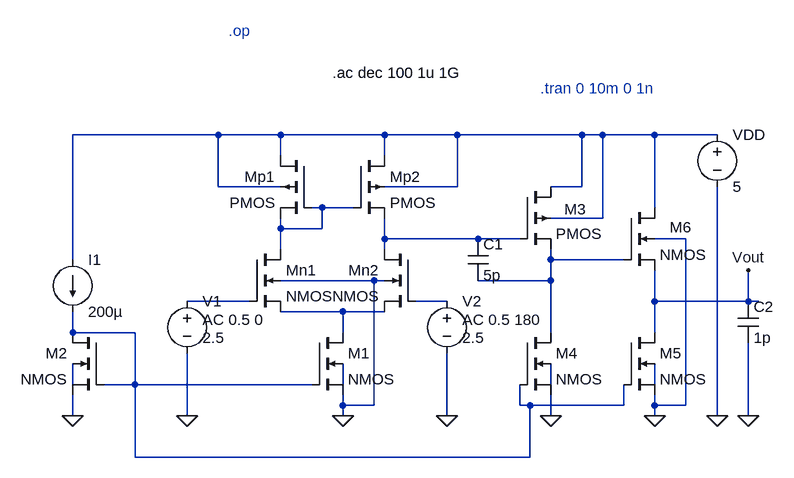
[diagram p0: schematic TWO STAGE DIFF AMPLIFIER PROJECT.asc]
TWO STAGE DIFF AMPLIFIER PROJECT.asc, the LTspice schematic file:
Version 4.1
SHEET 1 880 680
WIRE -240 0 -464 0
WIRE -144 0 -240 0
WIRE 16 0 -144 0
WIRE 128 0 16 0
WIRE 320 0 128 0
WIRE 352 0 320 0
WIRE 432 0 352 0
WIRE 528 0 432 0
WIRE -144 32 -144 0
WIRE 16 32 16 0
WIRE -240 80 -240 0
WIRE -144 80 -240 80
WIRE 128 80 128 0
WIRE 128 80 16 80
WIRE 320 80 320 0
WIRE 320 80 272 80
WIRE -80 112 -96 112
WIRE -32 112 -80 112
WIRE 432 112 432 0
WIRE 352 128 352 0
WIRE 352 128 272 128
WIRE -144 144 -144 128
WIRE -80 144 -80 112
WIRE -80 144 -144 144
WIRE 16 160 16 128
WIRE 160 160 16 160
WIRE 224 160 160 160
WIRE 480 160 432 160
WIRE -144 176 -144 144
WIRE 16 176 16 160
WIRE -464 192 -464 0
WIRE 272 192 272 176
WIRE 384 192 272 192
WIRE 0 224 -144 224
WIRE 16 224 0 224
WIRE 272 224 272 192
WIRE 272 224 160 224
WIRE -192 256 -288 256
WIRE 112 256 64 256
WIRE 432 256 432 208
WIRE 576 256 576 208
WIRE 576 256 432 256
WIRE 592 256 576 256
WIRE -48 272 -144 272
WIRE 16 272 -48 272
WIRE -464 304 -464 272
WIRE -368 304 -464 304
WIRE -48 304 -48 272
WIRE 272 304 272 224
WIRE 432 304 432 256
WIRE -464 384 -464 352
WIRE -368 384 -368 304
WIRE -368 384 -416 384
WIRE -96 384 -368 384
WIRE -48 384 -48 352
WIRE 272 384 272 352
WIRE 432 384 432 352
WIRE -48 416 -48 400
WIRE 0 416 0 224
WIRE 0 416 -48 416
WIRE 224 416 224 384
WIRE 240 416 224 416
WIRE 384 416 384 384
WIRE 384 416 240 416
WIRE 432 416 432 400
WIRE 480 416 480 160
WIRE 480 416 432 416
WIRE -464 432 -464 400
WIRE -288 432 -288 336
WIRE -48 432 -48 416
WIRE 112 432 112 336
WIRE 272 432 272 400
WIRE 432 432 432 416
WIRE 528 432 528 80
WIRE 576 432 576 320
WIRE -368 496 -368 384
WIRE 240 496 240 416
WIRE 240 496 -368 496
FLAG -48 432 0
FLAG -464 432 0
FLAG 272 432 0
FLAG 432 432 0
FLAG 528 432 0
FLAG -288 432 0
FLAG 112 432 0
FLAG 576 432 0
FLAG 576 208 Vout
SYMBOL current -464 192 R0
WINDOW 123 0 0 Left 0
WINDOW 39 0 0 Left 0
SYMATTR InstName I1
SYMATTR Value 200µ
SYMBOL voltage 528 -16 R0
WINDOW 123 0 0 Left 0
WINDOW 39 0 0 Left 0
SYMATTR InstName VDD
SYMATTR Value 5
SYMBOL cap 144 160 R0
SYMATTR InstName C1
SYMATTR Value 5p
SYMBOL voltage -288 240 R0
WINDOW 123 24 44 Left 2
WINDOW 39 0 0 Left 0
WINDOW 3 24 72 Left 2
SYMATTR Value2 AC 0.5 0
SYMATTR Value 2.5
SYMATTR InstName V1
SYMBOL voltage 112 240 R0
WINDOW 123 24 44 Left 2
WINDOW 39 0 0 Left 0
WINDOW 3 24 72 Left 2
SYMATTR Value2 AC 0.5 180
SYMATTR Value 2.5
SYMATTR InstName V2
SYMBOL cap 560 256 R0
SYMATTR InstName C2
SYMATTR Value 1p
SYMBOL pmos4 -32 32 R0
SYMATTR InstName Mp2
SYMATTR Value2 l=0.1u w=40u
SYMBOL pmos4 -96 32 M0
SYMATTR InstName Mp1
SYMATTR Value2 l=0.1u w=40u
SYMBOL nmos4 -192 176 R0
SYMATTR InstName Mn1
SYMATTR Value2 l=0.1u w=20u
SYMBOL nmos4 64 176 M0
SYMATTR InstName Mn2
SYMATTR Value2 l=0.1u w=20u
SYMBOL nmos4 -96 304 R0
SYMATTR InstName M1
SYMATTR Value2 l=2u w=10u
SYMBOL nmos4 -416 304 M0
SYMATTR InstName M2
SYMATTR Value2 l=2u w=10u
SYMBOL nmos4 384 304 R0
SYMATTR InstName M5
SYMATTR Value2 l=0.2u w=10u
SYMBOL nmos4 384 112 R0
WINDOW 0 71 30 Left 2
SYMATTR InstName M6
SYMATTR Value2 l=0.1u w=20u
SYMBOL pmos4 224 80 R0
WINDOW 0 69 34 Left 2
SYMATTR InstName M3
SYMATTR Value2 l=0.1u w=40u
SYMBOL nmos4 224 304 R0
SYMATTR InstName M4
SYMATTR Value2 l=0.2u w=10u
TEXT -224 -160 Left 2 ;.op
TEXT -64 -96 Left 2 !.ac dec 100 1u 1G
TEXT 256 -72 Left 2 ;.tran 0 10m 0 1n

The netlist it stands for:
* TWO STAGE DIFF AMPLIFIER PROJECT.asc
I1 N001 N008 200µ
VDD N001 0 5
C1 N003 N004 5p
V1 N005 0 2.5 AC 0.5 0
V2 N006 0 2.5 AC 0.5 180
C2 Vout 0 1p
Mp2 N001 N002 N003 N001 PMOS l=0.1u w=40u
Mp1 N001 N002 N002 N001 PMOS l=0.1u w=40u
Mn1 N002 N005 N007 0 NMOS l=0.1u w=20u
Mn2 N003 N006 N007 0 NMOS l=0.1u w=20u
M1 N007 N008 0 N010 NMOS l=2u w=10u
M2 N008 N008 0 N009 NMOS l=2u w=10u
M5 Vout N008 0 N012 NMOS l=0.2u w=10u
M6 N001 N004 Vout 0 NMOS l=0.1u w=20u
M3 N001 N003 N004 N001 PMOS l=0.1u w=40u
M4 N004 N008 0 N011 NMOS l=0.2u w=10u
.model NMOS NMOS
.model PMOS PMOS
.lib standard.mos
* .op
.ac dec 100 1u 1G
* .tran 0 10m 0 1n
.backanno
.end